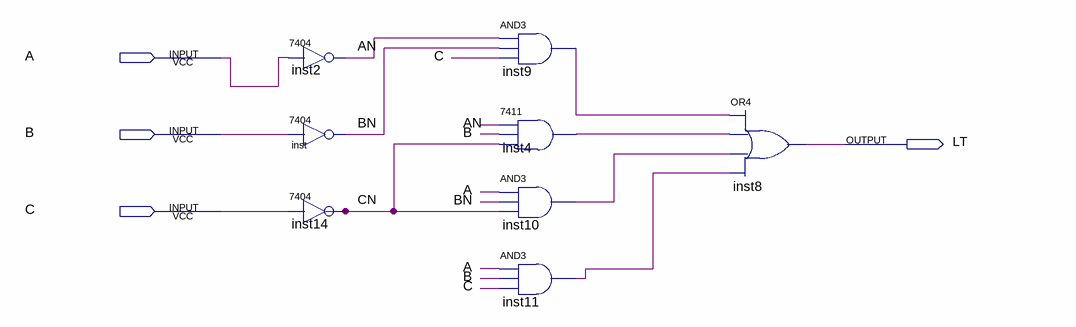
[diagram p0: schematic sheet]
// Quartus schematic Lab5a.bdf as structural Verilog: 8 symbols, 4 pins
module Lab5a (
  input  A,
  input  B,
  input  C,
  output LT
);

  wire AN, BN, CN, inst4_1, inst9_out, inst10_out, inst11_out;

  \7404  inst2 (.\2 (A), .\1 (AN));
  \7404  inst (.\2 (B), .\1 (BN));
  \7404  inst14 (.\2 (C), .\1 (CN));
  and inst9 (inst9_out, AN, BN, C);
  \7411  inst4 (.\2 (AN), .\3 (B), .\4 (CN), .\1 (inst4_1));
  and inst10 (inst10_out, A, BN, CN);
  and inst11 (inst11_out, A, B, C);
  or inst8 (LT, inst9_out, inst4_1, inst10_out, inst11_out);
endmodule
